# Altium schematic sheet 2SiPM_3.SchDoc
size A4
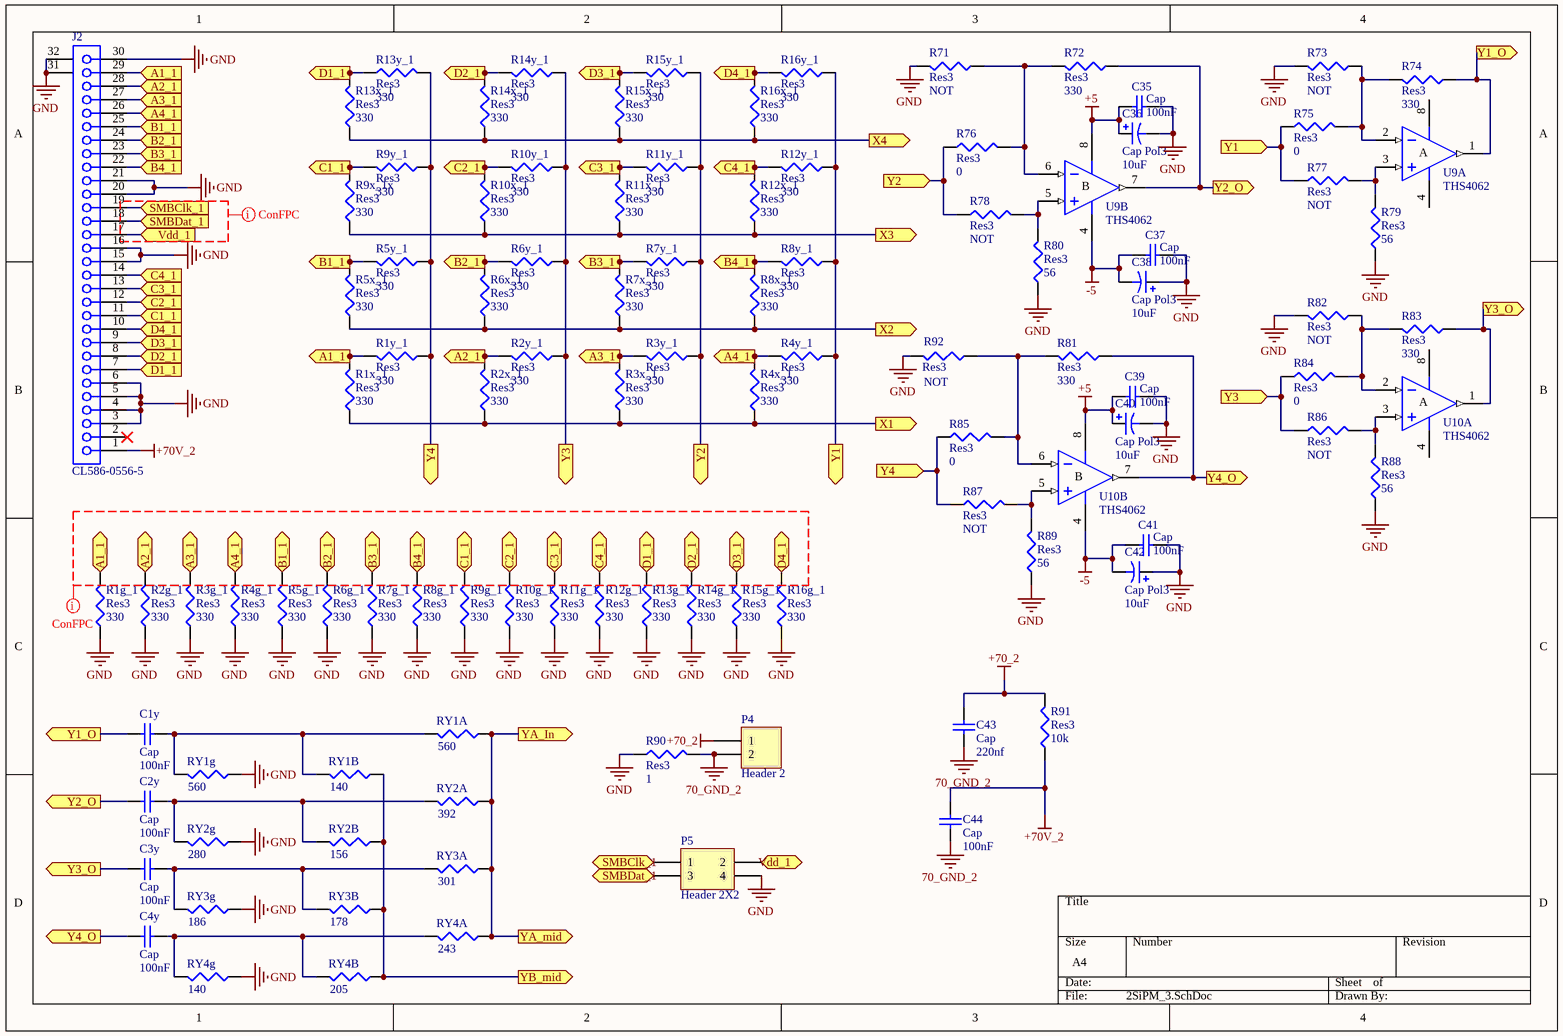
[diagram p0: 2SiPM_3.SchDoc]

## Parts
C1y  Cap  value 100nF  [1608[0603]]
C2y  Cap  value 100nF  [1608[0603]]
C3y  Cap  value 100nF  [1608[0603]]
C4y  Cap  value 100nF  [1608[0603]]
C35  Cap  value 100nF  [6-0805_N]
C36  Cap Pol3  value 10uF  [6-0805_N]
C37  Cap  value 100nF  [6-0805_N]
C38  Cap Pol3  value 10uF  [6-0805_N]
C39  Cap  value 100nF  [6-0805_N]
C40  Cap Pol3  value 10uF  [6-0805_N]
C41  Cap  value 100nF  [6-0805_N]
C42  Cap Pol3  value 10uF  [6-0805_N]
C43  Cap  value 220nf  [6-0805_N]
C44  Cap  value 100nF  [6-0805_N]
J2  CL586-0556-5  [FH12A-30S-0.5SH]
P4  Header 2  [HDR1X2]
P5  Header 2X2  [HDR2X2]
R1g_1  Res3  value 330  [0402]
R1x_1  Res3  value 330  [0402]
R1y_1  Res3  value 330  [0402]
R2g_1  Res3  value 330  [0402]
R2x_1  Res3  value 330  [0402]
R2y_1  Res3  value 330  [0402]
R3g_1  Res3  value 330  [0402]
R3x_1  Res3  value 330  [0402]
R3y_1  Res3  value 330  [0402]
R4g_1  Res3  value 330  [0402]
R4x_1  Res3  value 330  [0402]
R4y_1  Res3  value 330  [0402]
R5g_1  Res3  value 330  [0402]
R5x_1  Res3  value 330  [0402]
R5y_1  Res3  value 330  [0402]
R6g_1  Res3  value 330  [0402]
R6x_1  Res3  value 330  [0402]
R6y_1  Res3  value 330  [0402]
R7g_1  Res3  value 330  [0402]
R7x_1  Res3  value 330  [0402]
R7y_1  Res3  value 330  [0402]
R8g_1  Res3  value 330  [0402]
R8x_1  Res3  value 330  [0402]
R8y_1  Res3  value 330  [0402]
R9g_1  Res3  value 330  [0402]
R9x_1x  Res3  value 330  [0402]
R9y_1  Res3  value 330  [0402]
R10g_1  Res3  value 330  [0402]
R10x_1  Res3  value 330  [0402]
R10y_1  Res3  value 330  [0402]
R11g_1  Res3  value 330  [0402]
R11x_1  Res3  value 330  [0402]
R11y_1  Res3  value 330  [0402]
R12g_1  Res3  value 330  [0402]
R12x_1  Res3  value 330  [0402]
R12y_1  Res3  value 330  [0402]
R13g_1  Res3  value 330  [0402]
R13x_1  Res3  value 330  [0402]
R13y_1  Res3  value 330  [0402]
R14g_1  Res3  value 330  [0402]
R14x_1  Res3  value 330  [0402]
R14y_1  Res3  value 330  [0402]
R15g_1  Res3  value 330  [0402]
R15x_1  Res3  value 330  [0402]
R15y_1  Res3  value 330  [0402]
R16g_1  Res3  value 330  [0402]
R16x_1  Res3  value 330  [0402]
R16y_1  Res3  value 330  [0402]
R71  Res3  value NOT  [J1-0603]
R72  Res3  value 330  [J1-0603]
R73  Res3  value NOT  [J1-0603]
R74  Res3  value 330  [J1-0603]
R75  Res3  value 0  [J1-0603]
R76  Res3  value 0  [J1-0603]
R77  Res3  value NOT  [J1-0603]
R78  Res3  value NOT  [J1-0603]
R79  Res3  value 56  [J1-0603]
R80  Res3  value 56  [J1-0603]
R81  Res3  value 330  [J1-0603]
R82  Res3  value NOT  [J1-0603]
R83  Res3  value 330  [J1-0603]
R84  Res3  value 0  [J1-0603]
R85  Res3  value 0  [J1-0603]
R86  Res3  value NOT  [J1-0603]
R87  Res3  value NOT  [J1-0603]
R88  Res3  value 56  [J1-0603]
R89  Res3  value 56  [J1-0603]
R90  Res3  value 1  [6-0805_N]
R91  Res3  value 10k  [6-0805_N]
R92  Res3  value NOT  [J1-0603]
RY1A  value 560  [J1-0603]  (hidden comment: Res3)
RY1B  value 140  [J1-0603]  (hidden comment: Res3)
RY1g  value 560  [J1-0603]  (hidden comment: Res3)
RY2A  value 392  [J1-0603]  (hidden comment: Res3)
RY2B  value 156  [J1-0603]  (hidden comment: Res3)
RY2g  value 280  [J1-0603]  (hidden comment: Res3)
RY3A  value 301  [J1-0603]  (hidden comment: Res3)
RY3B  value 178  [J1-0603]  (hidden comment: Res3)
RY3g  value 186  [J1-0603]  (hidden comment: Res3)
RY4A  value 243  [J1-0603]  (hidden comment: Res3)
RY4B  value 205  [J1-0603]  (hidden comment: Res3)
RY4g  value 140  [J1-0603]  (hidden comment: Res3)
U9  THS4062  [SO-8_M]  (parts A,B of 2)
U10  THS4062  [SO-8_M]  (parts A,B of 2)

## Ports
A1_1 (in), A1_1 (out), A2_1 (in), A2_1 (out), A3_1 (in), A3_1 (out), A4_1 (in), A4_1 (out), B1_1 (in), B1_1 (out), B2_1 (in), B2_1 (out), B3_1 (in), B3_1 (out), B4_1 (in), B4_1 (out), C1_1 (in), C1_1 (out), C2_1 (in), C2_1 (out), C3_1 (in), C3_1 (out), C4_1 (in), C4_1 (out), D1_1 (in), D1_1 (out), D2_1 (in), D2_1 (out), D3_1 (in), D3_1 (out), D4_1 (in), D4_1 (out), SMBClk_1 (in), SMBClk_1 (out), SMBDat_1 (in), SMBDat_1 (out), Vdd_1 (in), Vdd_1 (out), X1 (out), X2 (out), X3 (out), X4 (out), Y1 (in), Y1 (out), Y1_O (out), Y2 (in), Y2 (out), Y2_O (out), Y3 (in), Y3 (out), Y3_O (out), Y4 (in), Y4 (out), Y4_O (out), YA_In (out), YA_mid (out), YB_mid (out)

## Nets
70_GND_2: C43.1 C44.1 P4.2 R90.2
+5: C35.2 C36.1 C39.2 C40.1 U9.8(V+) U10.8(V+)
+70_2: C43.2 P4.1 R91.2
+70V_2: C44.2 J2.1 R91.1
-5: C37.2 C38.2 C41.2 C42.2 U9.4(V-) U10.4(V-)
GND: C35.1 C36.2 C37.1 C38.1 C39.1 C40.2 C41.1 C42.1 J2.3 J2.4 J2.5 J2.6 J2.15 J2.16 J2.20 J2.21 J2.30 J2.31(MH1) J2.32(MH2) P5.4 R1g_1.1 R2g_1.1 R3g_1.1 R4g_1.1 R5g_1.1 R6g_1.1 R7g_1.1 R8g_1.1 R9g_1.1 R10g_1.1 R11g_1.1 R12g_1.1 R13g_1.1 R14g_1.1 R15g_1.1 R16g_1.1 R71.2 R73.2 R79.1 R80.1 R82.2 R88.1 R89.1 R90.1 R92.2 RY1g.1 RY2g.1 RY3g.1 RY4g.1
A1_1: J2.29 R1g_1.2 R1x_1.2 R1y_1.2 ; port A1_1
A2_1: J2.28 R2g_1.2 R2x_1.2 R2y_1.2 ; port A2_1
A3_1: J2.27 R3g_1.2 R3x_1.2 R3y_1.2 ; port A3_1
A4_1: J2.26 R4g_1.2 R4x_1.2 R4y_1.2 ; port A4_1
B1_1: J2.25 R5g_1.2 R5x_1.2 R5y_1.2 ; port B1_1
B2_1: J2.24 R6g_1.2 R6x_1.2 R6y_1.2 ; port B2_1
B3_1: J2.23 R7g_1.2 R7x_1.2 R7y_1.2 ; port B3_1
B4_1: J2.22 R8g_1.2 R8x_1.2 R8y_1.2 ; port B4_1
C1_1: J2.11 R9g_1.2 R9x_1x.2 R9y_1.2 ; port C1_1
C2_1: J2.12 R10g_1.2 R10x_1.2 R10y_1.2 ; port C2_1
C3_1: J2.13 R11g_1.2 R11x_1.2 R11y_1.2 ; port C3_1
C4_1: J2.14 R12g_1.2 R12x_1.2 R12y_1.2 ; port C4_1
D1_1: J2.7 R13g_1.2 R13x_1.2 R13y_1.1 ; port D1_1
D2_1: J2.8 R14g_1.2 R14x_1.2 R14y_1.2 ; port D2_1
D3_1: J2.9 R15g_1.2 R15x_1.2 R15y_1.2 ; port D3_1
D4_1: J2.10 R16g_1.2 R16x_1.2 R16y_1.2 ; port D4_1
SMBClk_1: J2.19 P5.1 ; port SMBClk_1
SMBDat_1: J2.18 P5.3 ; port SMBDat_1
Vdd_1: J2.17 P5.2 ; port Vdd_1
X1: R1x_1.1 R2x_1.1 R3x_1.1 R4x_1.1 ; port X1
X2: R5x_1.1 R6x_1.1 R7x_1.1 R8x_1.1 ; port X2
X3: R9x_1x.1 R10x_1.1 R11x_1.1 R12x_1.1 ; port X3
X4: R13x_1.1 R14x_1.1 R15x_1.1 R16x_1.1 ; port X4
Y1: R4y_1.1 R8y_1.1 R12y_1.1 R16y_1.1 R75.1 R77.1 ; port Y1
Y1_O: C1y.1 R74.1 U9.1(OUT) ; port Y1_O
Y2: R3y_1.1 R7y_1.1 R11y_1.1 R15y_1.1 R76.1 R78.1 ; port Y2
Y2_O: C2y.1 R72.1 U9.7(OUT) ; port Y2_O
Y3: R2y_1.1 R6y_1.1 R10y_1.1 R14y_1.1 R84.1 R86.1 ; port Y3
Y3_O: C3y.1 R83.1 U10.1(OUT) ; port Y3_O
Y4: R1y_1.1 R5y_1.1 R9y_1.1 R13y_1.2 R85.1 R87.1 ; port Y4
Y4_O: C4y.1 R81.1 U10.7(OUT) ; port Y4_O
YA_In: RY1A.1 RY2A.1 RY3A.1 RY4A.1 ; port YA_In, port YA_mid
YB_mid: RY1B.1 RY2B.1 RY3B.1 RY4B.1 ; port YB_mid
NetC1y_2: C1y.2 RY1A.2 RY1B.2 RY1g.2
NetC2y_2: C2y.2 RY2A.2 RY2B.2 RY2g.2
NetC3y_2: C3y.2 RY3A.2 RY3B.2 RY3g.2
NetC4y_2: C4y.2 RY4A.2 RY4B.2 RY4g.2
NetR71_1: R71.1 R72.2 R76.2 U9.6(IN-)
NetR73_1: R73.1 R74.2 R75.2 U9.2(IN-)
NetR77_2: R77.2 R79.2 U9.3(IN+)
NetR78_2: R78.2 R80.2 U9.5(IN+)
NetR81_2: R81.2 R85.2 R92.1 U10.6(IN-)
NetR82_1: R82.1 R83.2 R84.2 U10.2(IN-)
NetR86_2: R86.2 R88.2 U10.3(IN+)
NetR87_2: R87.2 R89.2 U10.5(IN+)

Not connected (* = marked no-connect by the designer): J2 2*

## Layout directives
net class Undefined: (no net found under the mark)

## Notes on the sheet
- (in symbol AD8002AR, part A) A
- (in symbol AD8002AR, part B) B

## Library data of the parts
C1y C2y C3y C4y C35 C37 C39 C41 C43 C44 = Cap: Capacitor; Published: 8-Jun-2000; LatestRevisionDate: 17-Jul-2002; LatestRevisionNote: Re-released for DXP Platform.; PackageReference: RAD-0.3; Publisher: Altium Limited; PackageDescription: Radial Cap, Thru-Hole; 2 Leads; 0.3 in Pin Spacing
C36 C38 C40 C42 = Cap Pol3: Polarized Capacitor (Surface Mount); Published: 8-Jun-2000; LatestRevisionDate: 29-May-2009; LatestRevisionNote: IPC-7351 Footprint Added.; PackageReference: C0805; Publisher: Altium Limited; PackageDescription: Chip Capacitor
J2 = CL586-0556-5: FH12 Series, "Flip-Lock" SMT/ZIF FFC/FPC Connector - 0.5mm Spaced Top Contact; Positions: 30; ContactMaterial: Phosphor Bronze; Current: 0.4A; PCB_Layout: Complies with manufacturer's recommendation.; Note: Pad dimensions follow nominal values, Suitable for Wave Soldering, Adjust for Re-flow.; Published: 17-Jul-2002; DatasheetVersion: 13-Nov-2000; PackageVersion: 13-Nov-2000; PackageReference: FH12A-30S-0.5SH; Publisher: Altium Limited; ComponentLink1Description: Manufacturer Link; ComponentLink1URL: http://www.hiroseusa.com/; ComponentLink2Description: Datasheet; ComponentLink2URL: http://www.hirose.co.jp/cataloge_hp/e58605370.pdf
P4 = Header 2: Header, 2-Pin; LatestRevisionDate: 17-Jul-2002; LatestRevisionNote: Re-released for DXP Platform.; Publisher: Altium Limited
P5 = Header 2X2: Header, 2-Pin, Dual row; LatestRevisionDate: 17-Jul-2002; LatestRevisionNote: Re-released for DXP Platform.; Publisher: Altium Limited
R1g_1 R1x_1 R1y_1 R2g_1 R2x_1 R2y_1 R3g_1 R3x_1 R3y_1 R4g_1 R4x_1 R4y_1 R5g_1 R5x_1 R5y_1 R6g_1 R6x_1 R6y_1 R7g_1 R7x_1 R7y_1 R8g_1 R8x_1 R8y_1 R9g_1 R9x_1x R9y_1 R10g_1 R10x_1 R10y_1 R11g_1 R11x_1 R11y_1 R12g_1 R12x_1 R12y_1 R13g_1 R13x_1 R13y_1 R14g_1 R14x_1 R14y_1 R15g_1 R15x_1 R15y_1 R16g_1 R16x_1 R16y_1 R71-R92 RY1A RY1B RY1g RY2A RY2B RY2g RY3A RY3B RY3g RY4A RY4B RY4g = Res3: Resistor; Published: 8-Jun-2000; LatestRevisionDate: 29-May-2009; LatestRevisionNote: IPC-7351 Footprint Added.; PackageReference: J1-0603; Publisher: Altium Limited; PackageDescription: Chip Resistor
U9 U10 = AD8002AR: Dual 600MHz, 50mW Current Feedback Amplifier; Published: 8-Jun-2000; LatestRevisionDate: 13-Apr-2006; LatestRevisionNote: IPC-7351 Footprint Added.; DatasheetVersion: REV. C 1999; PackageVersion: revA; PackageReference: SO-8; Publisher: Altium Limited; PackageDescription: 8-Pin Small Outline Integrated Circuit 1.27 mm Pitch; Code_JEDEC: MS-012-AA; Code_IPC: SOIC127P600-8; ComponentLink1Description: Manufacturer Link; ComponentLink1URL: http://www.analog.com/en/prod/0,,759_786_AD8002%2C00.html; ComponentLink2Description: Datasheet; ComponentLink2URL: http://www.analog.com/UploadedFiles/Data_Sheets/147523773AD8002_d.pdf